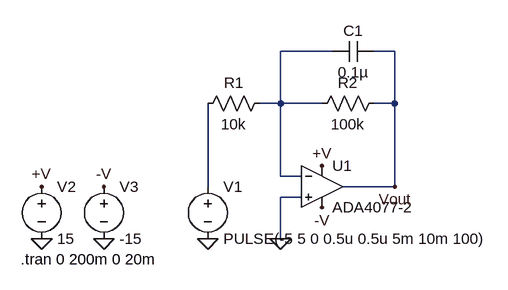
[diagram p0: schematic Draft2.asc]
Draft2.asc, the LTspice schematic file:
Version 4.1
SHEET 1 880 680
WIRE 400 -64 320 -64
WIRE 496 -64 464 -64
WIRE 320 16 320 -64
WIRE 320 16 288 16
WIRE 384 16 320 16
WIRE 496 16 496 -64
WIRE 496 16 464 16
WIRE 320 128 320 16
WIRE 352 128 320 128
WIRE 208 144 208 16
WIRE 496 144 496 16
WIRE 496 144 416 144
WIRE 352 160 320 160
WIRE 320 224 320 160
FLAG -48 224 0
FLAG 48 224 0
FLAG -48 144 +V
FLAG 384 112 +V
FLAG 48 144 -V
FLAG 384 176 -V
FLAG 208 224 0
FLAG 320 224 0
FLAG 496 144 Vout
SYMBOL OpAmps\\ADA4077-2 384 80 R0
SYMATTR InstName U1
SYMBOL res 304 0 R90
WINDOW 0 0 56 VBottom 2
WINDOW 3 32 56 VTop 2
SYMATTR InstName R1
SYMATTR Value 10k
SYMBOL res 480 0 R90
WINDOW 0 0 56 VBottom 2
WINDOW 3 32 56 VTop 2
SYMATTR InstName R2
SYMATTR Value 100k
SYMBOL voltage 208 128 R0
WINDOW 123 0 0 Left 0
WINDOW 39 0 0 Left 0
SYMATTR InstName V1
SYMATTR Value PULSE(-5 5 0 0.5u 0.5u 5m 10m 100)
SYMBOL voltage -48 128 R0
WINDOW 123 0 0 Left 0
WINDOW 39 0 0 Left 0
SYMATTR InstName V2
SYMATTR Value 15
SYMBOL voltage 48 128 R0
WINDOW 123 0 0 Left 0
WINDOW 39 0 0 Left 0
SYMATTR InstName V3
SYMATTR Value -15
SYMBOL cap 464 -80 R90
WINDOW 0 0 32 VBottom 2
WINDOW 3 32 32 VTop 2
SYMATTR InstName C1
SYMATTR Value 0.1µ
TEXT -80 256 Left 2 !.tran 0 200m 0 20m

The netlist it stands for:
* Draft2.asc
X§U1 0 N001 +V -V Vout ADA4077-2  ; pins In+ In- V+ V- OUT
R1 N001 N002 10k
R2 Vout N001 100k
V1 N002 0 PULSE(-5 5 0 0.5u 0.5u 5m 10m 100)
V2 +V 0 15
V3 -V 0 -15
C1 Vout N001 0.1µ
.tran 0 200m 0 20m
.backanno
.end